# EAGLE design Propeller board rev 1.5 (EAGLE 9.2.2)
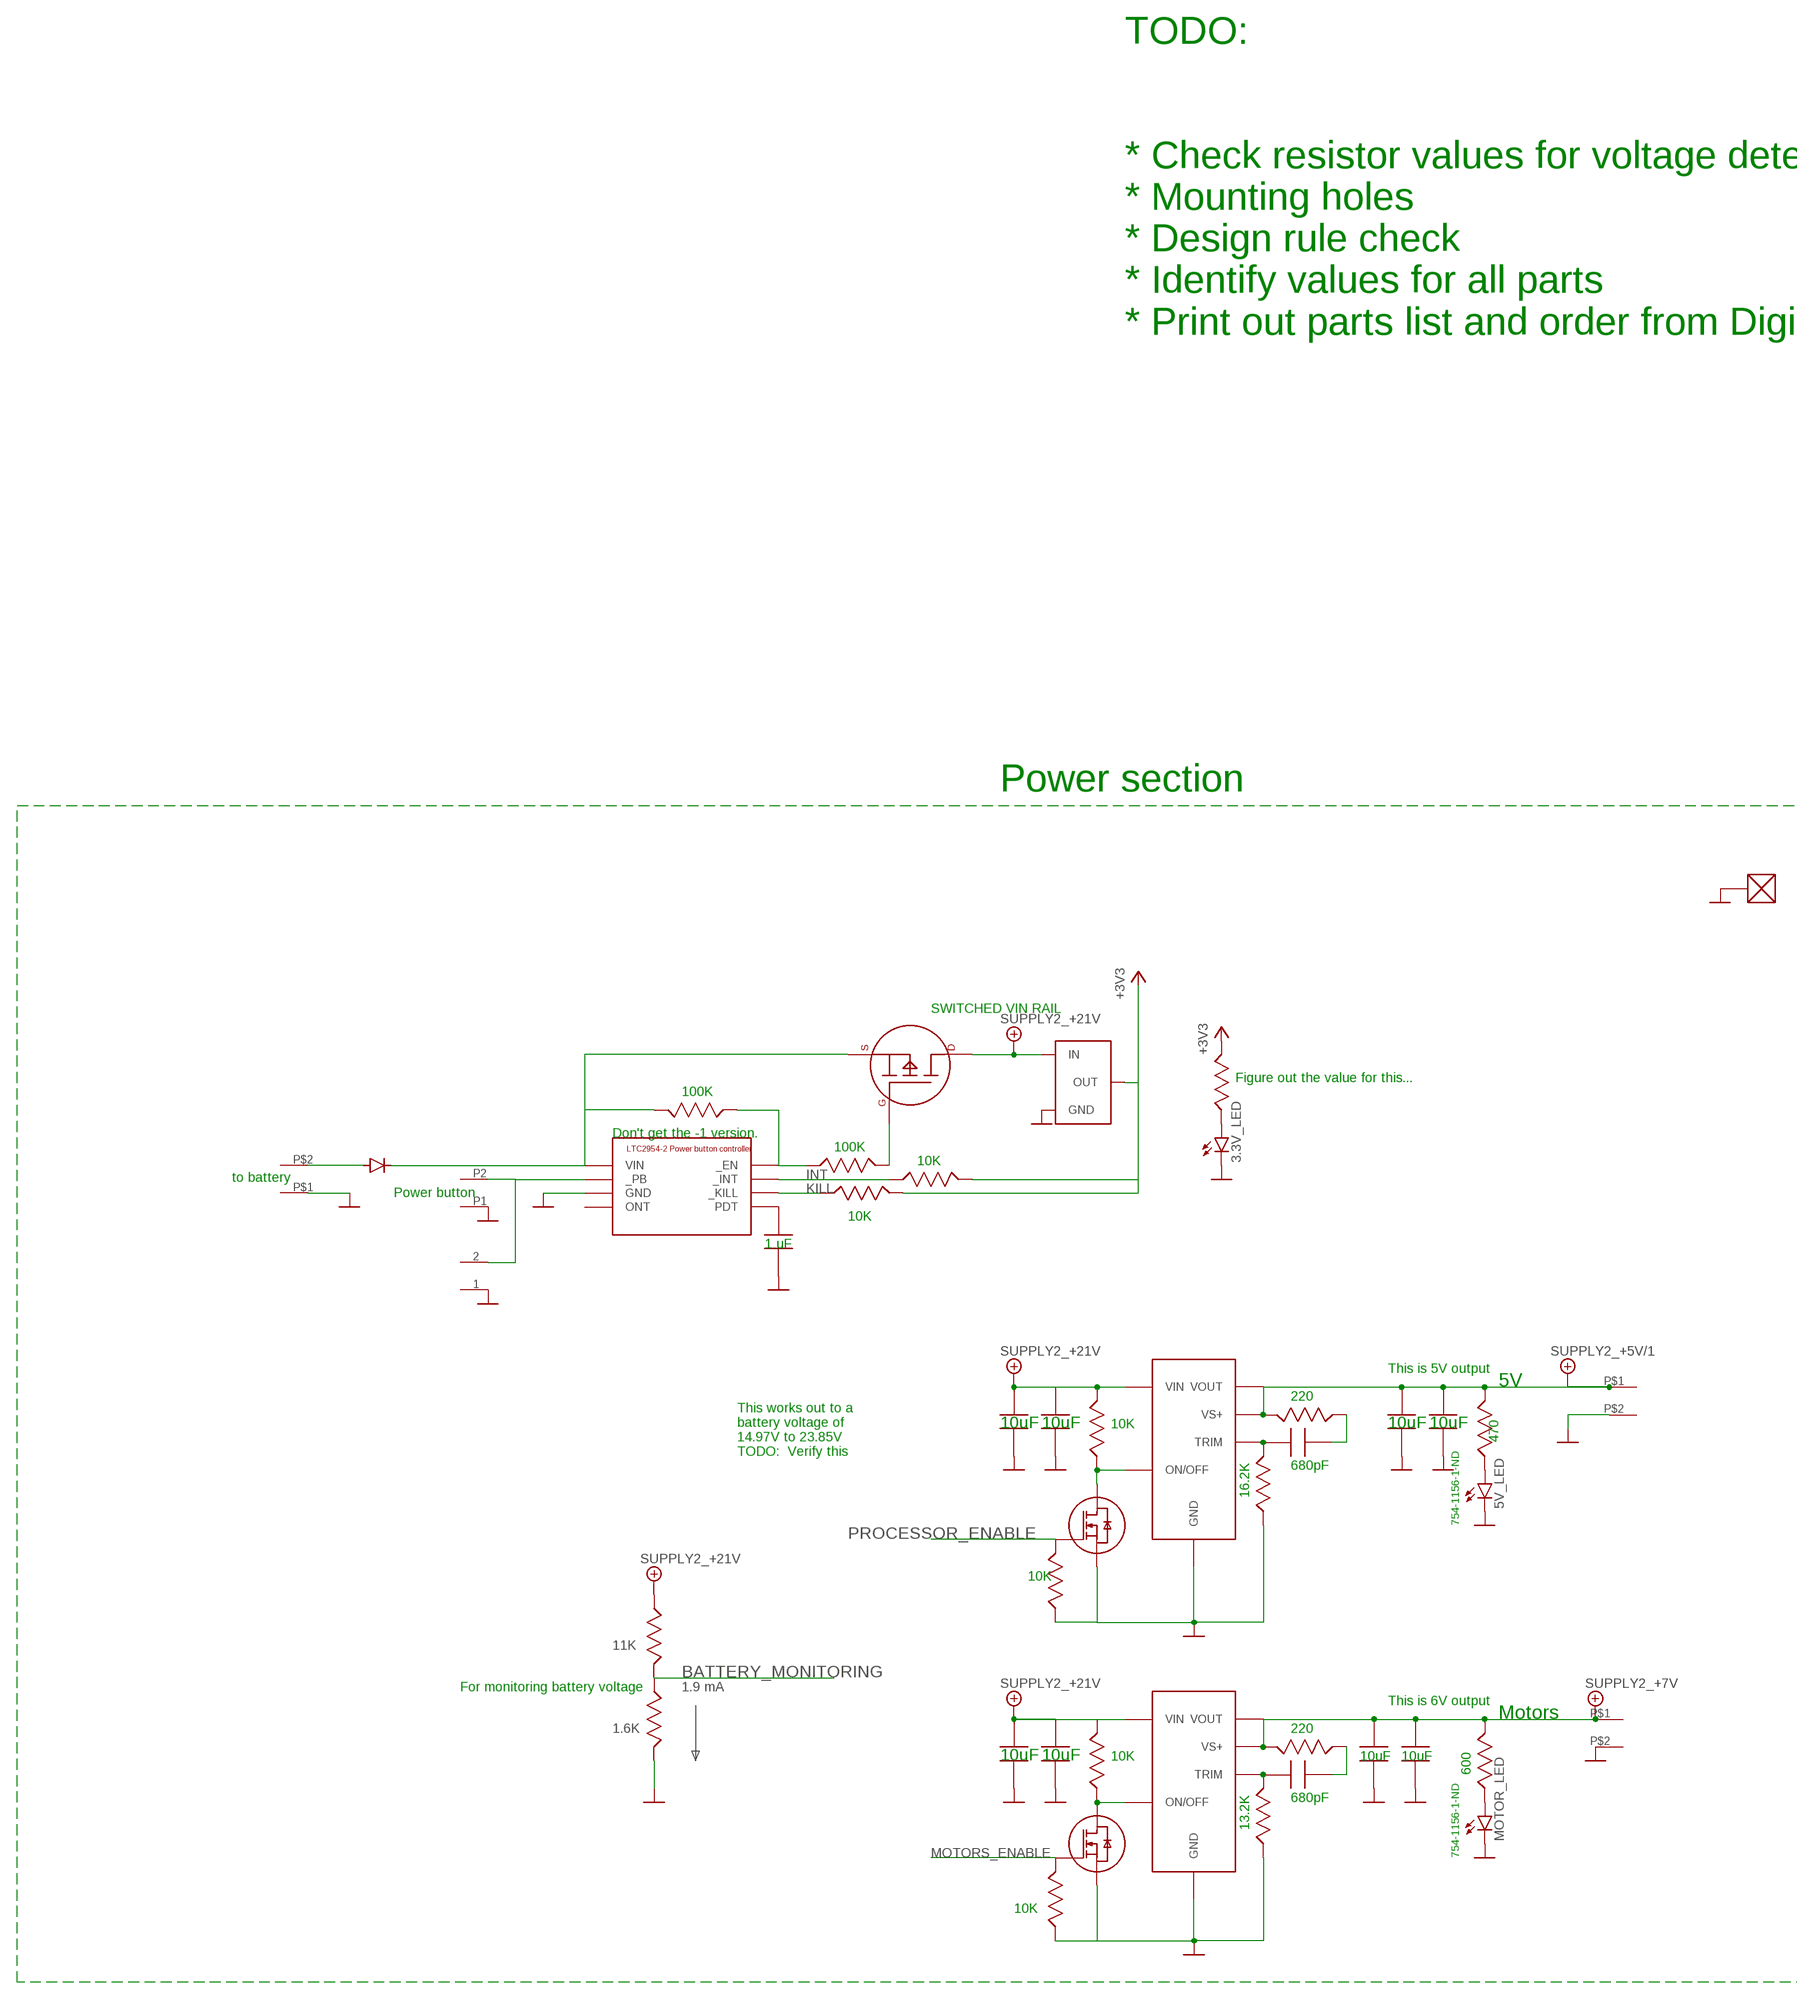
[diagram p0: schematic, sheet 1, part 1 of 2]
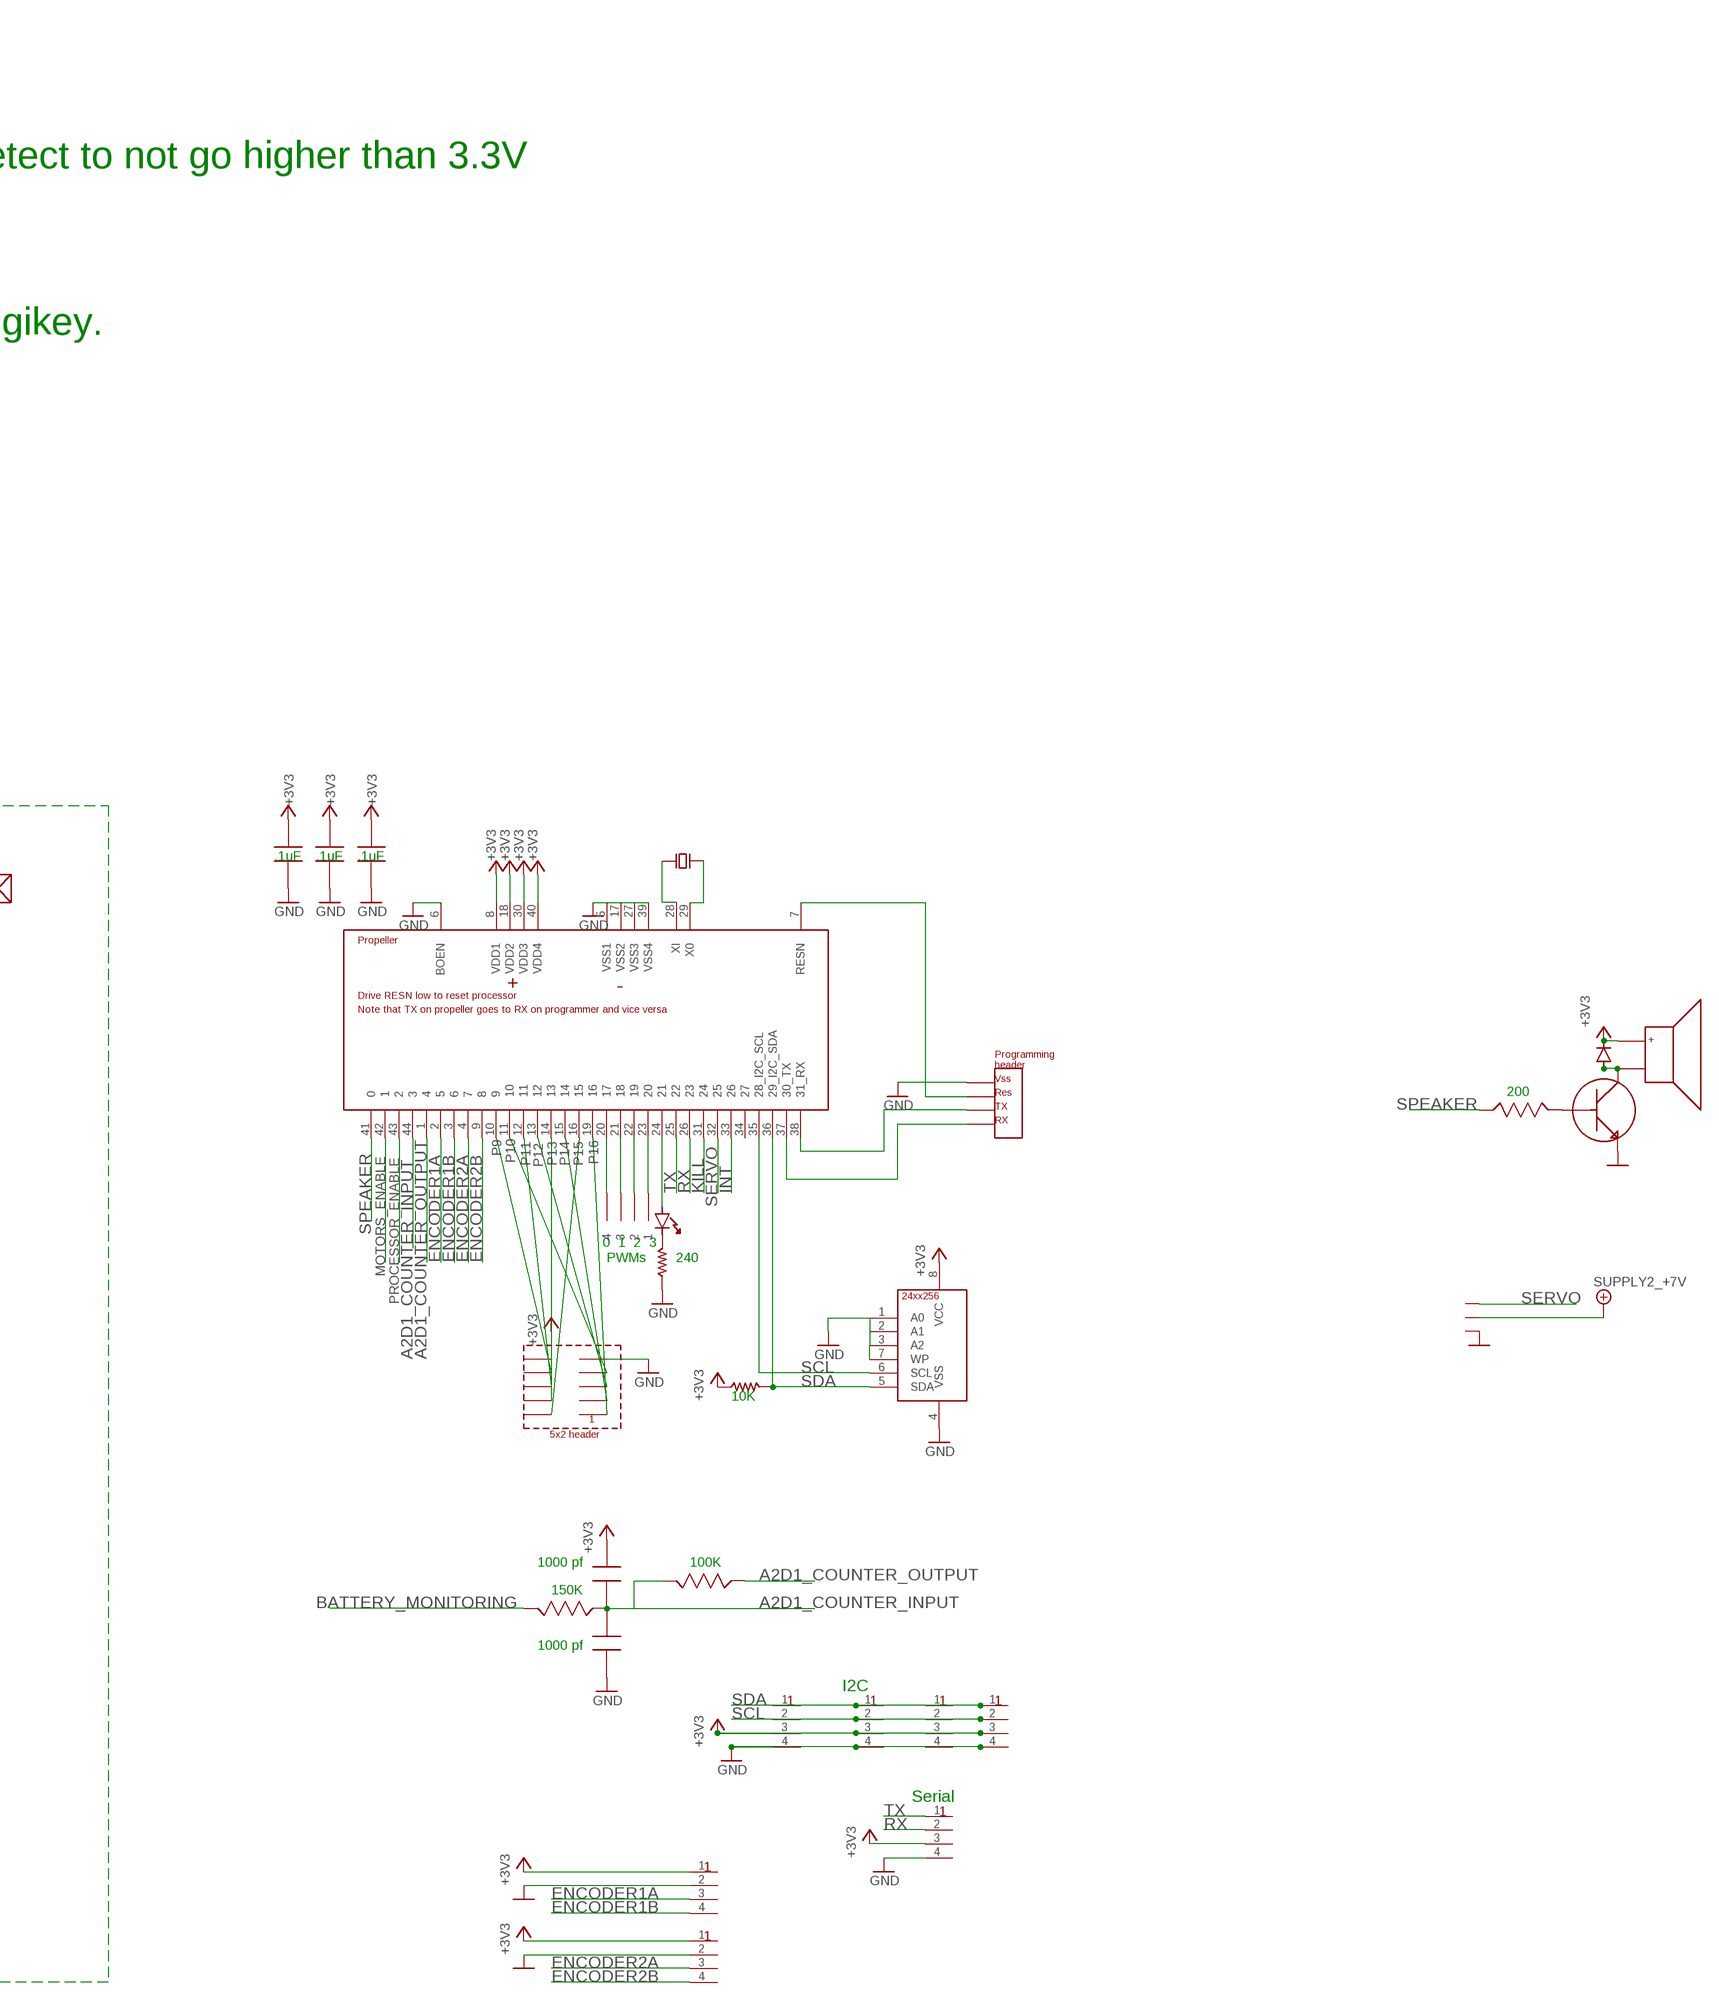
[diagram p1: schematic, sheet 1, part 2 of 2]

## Parts
3.3V_LED  LED_LEDSML1206  [LED_SML1206]
3V3_REGULATOR_FOR_PROPELLER  VOLTAGE_REGULATOR_3_TERMINALXP_POWER_VR05_SERIES  [VR05_SERIES_VREG]
5V_C_680PF  680pf  JACK_CAPACITOR0805  [JACK_0805]
5V_LED  LED_LEDSML1206  [LED_SML1206]
5V_LED_R1  470  JACK_RESISTOR0805  [JACK_0805]
5V_LED_R2  470  JACK_RESISTOR0805  [JACK_0805]
5V_R_220  220  JACK_RESISTOR0805  [JACK_0805]
5V_REGULATOR_PULLUP  10K  JACK_RESISTOR0805  [JACK_0805]
BATTERY_VOLTAGE_DIVIDER_HIGH  11K  JACK_RESISTOR0805  [JACK_0805]
BATTERY_VOLTAGE_DIVIDER_LOW  1.6K  JACK_RESISTOR0805  [JACK_0805]
MOTOR_C_680PF  680pf  JACK_CAPACITOR0805  [JACK_0805]
MOTOR_ENABLE_MOSFET  JACK_MOSFET_N_CHANNELBSS138LCT-ND  [JACK_SOT23]
MOTOR_ENABLE_MOSFET1  JACK_MOSFET_N_CHANNELBSS138LCT-ND  [JACK_SOT23]
MOTOR_LED  LED_LEDSML1206  [LED_SML1206]
MOTOR_LED_R  600  JACK_RESISTOR0805  [JACK_0805]
MOTOR_MOSFET_PULLDOWN  10K  JACK_RESISTOR0805  [JACK_0805]
MOTOR_PULLUP  10K  JACK_RESISTOR0805  [JACK_0805]
MOTOR_PULLUP2  10K  JACK_RESISTOR0805  [JACK_0805]
MOTOR_R_220  220  JACK_RESISTOR0805  [JACK_0805]
MOTOR_TRIM  13.2K  JACK_RESISTOR0805  [JACK_0805]
R1  240  RESISTOR0805  [805_SMD]
R25  10k  RESISTOR0805  [805_SMD]
RTRIM_5V  16.2K  JACK_RESISTOR0805  [JACK_0805]
U1  PARALLAX_PROPELLER  [44LQFP]
U2  EEPROM_24XX256  [8_MSOP]
U$1  CONNECTOR_2_PINJST_PH_SERIES  [JST_2_PIN_PH_SERIES]
U$2  JACK_SCREW_TERMINAL_2_CONDUCTORAMP-282837-2  [JACK_AMP-282837-2]
U$3  POWER_CONTROLLER_LTC2954-2TSOT-23-8  [TSOT-23-8]
U$4  JACK_DC_TO_DC_VARIABLE_555-1172-1-ND  [JACK_DC2DC_555-1172-1-ND]
U$5  1uf  CAPACITOR0805  [0805]
U$6  JACK_SCREW_TERMINAL_2_CONDUCTORAMP-282837-2  [JACK_AMP-282837-2]
U$7  100K  RESISTOR0805  [0805]
U$9  100K  RESISTOR0805  [0805]
U$10  10K  RESISTOR0805  [0805]
U$11  1000pF or 1nF  CAPACITOR0805  [0805]
U$12  MOSFET_P_CHANNELSI4431CDY  [SO8]
U$13  JACK_SCREW_TERMINAL_2_CONDUCTORAMP-282837-2  [JACK_AMP-282837-2]
U$14  .1uf  CAPACITOR0805  [0805]
U$15  CRYSTAL8X4.5_PACKAGE  [CRYSTAL_NX8045GB-5MHZ-STD-CSF-3]
U$16  .1uf  CAPACITOR0805  [0805]
U$17  JACK_DC_TO_DC_VARIABLE_555-1172-1-ND  [JACK_DC2DC_555-1172-1-ND]
U$18  .1uf  CAPACITOR0805  [0805]
U$19  TEST_POINT  [KEYSTONE_ELECTRONICS_5118_TEST_POINT]
U$20  LED0805  [0805]
U$21  HEADER_4_PIN_.1"  [FOUR_.1"_HOLES]
U$22  HEADER_5X2  [HEADER_5X2_.1"_SPACING]
U$23  CONNECTOR_4_PINJST_PH_SERIES  [JST_4_PIN_PH_SERIES]
U$24  CONNECTOR_4_PINJST_PH_SERIES  [JST_4_PIN_PH_SERIES]
U$25  CONNECTOR_4_PINJST_PH_SERIES  [JST_4_PIN_PH_SERIES]
U$26  CONNECTOR_2_PINJST_.1"  [JST_2_PIN_.1"]
U$27  10K  RESISTOR0805  [0805]
U$28  10uF  CAPACITOR  [1210]
U$29  10uF  CAPACITOR  [1210]
U$30  10uf  CAPACITOR  [1210]
U$31  10uf  CAPACITOR  [1210]
U$32  10uf  CAPACITOR  [1210]
U$33  10uf  CAPACITOR  [1210]
U$34  SPEAKERGT-0950RP3  [AUDIO_TRANSDUCER_GT-0950RP3]
U$35  DIODESOD523F  [SOD523F]
U$36  TRANSISTOR_NPNMMBT3904  [SOT23]
U$37  200  RESISTOR0805  [0805]
U$38  CONNECTOR_3_PIN.1"SPACING  [THREE_.1"_HOLES]
U$39  DIODEPOWER_DI15  [POWER_DI15]
U$40  10uf  CAPACITOR  [1210]
U$41  10uf  CAPACITOR  [1210]
U$42  1000pf or 1 nF  CAPACITOR0805  [0805]
U$43  150K  RESISTOR0805  [0805]
U$44  100K  RESISTOR0805  [0805]
U$45  CONNECTOR_4_PINJST_PH_SERIES  [JST_4_PIN_PH_SERIES]
U$46  CONNECTOR_4_PINJST_PH_SERIES  [JST_4_PIN_PH_SERIES]
U$47  CONNECTOR_4_PINJST_PH_SERIES  [JST_4_PIN_PH_SERIES]
U$48  PROPELLER_PROGRAMMING_HEADERHOLES  [FOUR_.1"HOLES]
U$49  CONNECTOR_4_PINJST_PH_SERIES  [JST_4_PIN_PH_SERIES]

## Nets
+3V3: 3V3_REGULATOR_FOR_PROPELLER.VOUT(OUT) 5V_LED_R2.P$3 R25.P$1 U1.8(VDD1) U1.18(VDD2) U1.30(VDD3) U1.40(VDD4) U2.8(VCC) U$10.C2 U$11.C2(2-) U$14.C2(2-) U$16.C2(2-) U$18.C2(2-) U$22.P10 U$23.3 U$24.3 U$25.3 U$27.C2 U$34.+ U$35.C U$45.3 U$46.1 U$47.3 U$49.1
+5V/1: 5V_LED_R1.P$3 5V_R_220.P$3 U$2.P$1 U$4.VOUT U$4.VS+ U$30.2(2-) U$33.2(2-) ; supply symbol labelled SUPPLY2_+5V/1
+7V: MOTOR_LED_R.P$3 MOTOR_R_220.P$3 U$13.P$1 U$17.VOUT U$17.VS+ U$32.2(2-) U$38.2 U$40.2(2-) ; supply symbol labelled SUPPLY2_+7V
+21V: 3V3_REGULATOR_FOR_PROPELLER.VIN(IN) 5V_REGULATOR_PULLUP.P$3 BATTERY_VOLTAGE_DIVIDER_HIGH.P$2 MOTOR_PULLUP.P$3 U$4.VIN U$12.5(D) U$12.6(D) U$12.7(D) U$12.8(D) U$17.VIN U$28.2(2-) U$29.2(2-) U$31.2(2-) U$41.2(2-) ; supply symbol labelled SUPPLY2_+21V
A2D1_COUNTER_INPUT: U1.44 U$11.A1(1+) U$42.C2(2-) U$43.A1 U$44.C2
A2D1_COUNTER_OUTPUT: U1.1 U$44.A1
BATTERY_MONITORING: BATTERY_VOLTAGE_DIVIDER_HIGH.P$3 BATTERY_VOLTAGE_DIVIDER_LOW.P$2 U$43.C2
ENCODER1A: U1.2 U$46.3
ENCODER1B: U1.3 U$46.4
ENCODER2A: U1.4 U$49.3
ENCODER2B: U1.9 U$49.4
GND: 3.3V_LED.C 3V3_REGULATOR_FOR_PROPELLER.GND 5V_LED.C BATTERY_VOLTAGE_DIVIDER_LOW.P$3 MOTOR_ENABLE_MOSFET1.2(S) MOTOR_ENABLE_MOSFET.2(S) MOTOR_LED.C MOTOR_MOSFET_PULLDOWN.P$2 MOTOR_PULLUP2.P$2 MOTOR_TRIM.P$2 R1.P$1 RTRIM_5V.P$2 U1.5(VSS1) U1.6(BOEN) U1.17(VSS2) U1.27(VSS3) U1.39(VSS4) U2.1(A0) U2.2(A1) U2.3(A2) U2.4(VSS) U2.7(WP) U$1.P1 U$2.P$2 U$3.4(GND) U$4.GND U$5.A1(1+) U$6.P$1 U$13.P$2 U$14.A1(1+) U$16.A1(1+) U$17.GND U$18.A1(1+) U$19.P1 U$22.P9 U$23.4 U$24.4 U$25.4 U$26.1 U$28.1(1+) U$29.1(1+) U$30.1(1+) U$31.1(1+) U$32.1(1+) U$33.1(1+) U$36.2(E) U$38.1 U$40.1(1+) U$41.1(1+) U$42.A1(1+) U$45.4 U$46.2 U$47.4 U$48.1(VSS) U$49.2 ; supply symbol labelled SUPPLY1_GND
INT: U1.33 U$3.5(_INT) U$10.A1
KILL: U1.31 U$3.8(_KILL) U$27.A1
MOTORS_ENABLE: MOTOR_ENABLE_MOSFET.1(G) MOTOR_MOSFET_PULLDOWN.P$3 U1.42
N$1: U1.7(RESN) U$48.2(RES)
N$3: U1.24 U$20.A1(A)
N$4: U$1.P2 U$3.2(_PB) U$26.2
N$5: MOTOR_LED.A MOTOR_LED_R.P$2
N$6: U$3.1(VIN) U$7.C2 U$12.1(S) U$12.2(S) U$12.3(S) U$39.3(C)
N$7: U$3.7(PDT) U$5.C2(2-)
N$8: U$3.6(_EN) U$7.A1 U$9.A1
N$9: MOTOR_ENABLE_MOSFET.3(D) MOTOR_PULLUP.P$2 U$17.ON/OFF
N$10: U$9.C2 U$12.4(G)
N$11: R1.P$2 U$20.C2(C)
N$12: U1.23 U$21.1
N$13: U1.22 U$21.2
N$14: U1.21 U$21.3
N$15: U$34.- U$35.A U$36.3(C)
N$16: U$36.1(B) U$37.C2
N$17: U1.20 U$21.4
N$21: 5V_C_680PF.P$3 RTRIM_5V.P$3 U$4.TRIM
N$23: 3.3V_LED.A 5V_LED_R2.P$2
N$24: U$6.P$2 U$39.1(A) U$39.2(A)
N$26: U1.38(31_RX) U$48.3(TX)
N$29: 5V_LED.A 5V_LED_R1.P$2
N$32: 5V_REGULATOR_PULLUP.P$2 MOTOR_ENABLE_MOSFET1.3(D) U$4.ON/OFF
N$33: 5V_C_680PF.P$2 5V_R_220.P$2
N$35: MOTOR_C_680PF.P$3 MOTOR_TRIM.P$3 U$17.TRIM
N$37: MOTOR_C_680PF.P$2 MOTOR_R_220.P$2
N$299: U1.37(30_TX) U$48.4(RX)
N$300: U1.28(XI) U$15.1
N$301: U1.29(X0) U$15.2
P9: U1.10 U$22.P8
P10: U1.11 U$22.P7
P11: U1.12 U$22.P6
P12: U1.13 U$22.P5
P13: U1.14 U$22.P4
P14: U1.15 U$22.P3
P15: U1.16 U$22.P2
P16: U1.19 U$22.P1
PROCESSOR_ENABLE: MOTOR_ENABLE_MOSFET1.1(G) MOTOR_PULLUP2.P$3 U1.43
RX: U1.26 U$47.2
SCL: U1.35(28_I2C_SCL) U2.6(SCL) U$23.2 U$24.2 U$25.2 U$45.2
SDA: R25.P$2 U1.36(29_I2C_SDA) U2.5(SDA) U$23.1 U$24.1 U$25.1 U$45.1
SERVO: U1.32 U$38.3
SPEAKER: U1.41 U$37.A1
TX: U1.25 U$47.1
Unconnected: U1.34 U$3.3(ONT)

## Notes on the sheet
- TODO:
  
  
  * Check resistor values for voltage detect to not go higher than 3.3V
  * Mounting holes
  * Design rule check
  * Identify values for all parts
  * Print out parts list and order from Digikey.
- Power section
- .1uF | .1uF | .1uF
- SWITCHED VIN RAIL
- Figure out the value for this...
- 100K | 200
- Don't get the -1 version.
- 100K
- 10K
- to battery
- Power button
- 10K
- 1 uF | 0  1  2  3
- PWMs | 240
- This is 5V output
- 5V
- 220 | 10K
- 10uF | 10uF | 10K | 10uF | 10uF
- 470
- This works out to a
  battery voltage of
  14.97V to 23.85V
  TODO:  Verify this
- 680pF
- 16.2K
- 754-1156-1-ND
- 1000 pf | 100K
- 10K
- 150K
- 11K | 1000 pf
- For monitoring battery voltage | 1.9 mA | I2C
- This is 6V output
- Motors
- 1.6K | 220
- 10uF | 10uF | 10K | 10uF | 10uF
- 600
- 680pF | Serial
- 13.2K
- 754-1156-1-ND
- 10K

## Library data of the parts
3.3V_LED 5V_LED MOTOR_LED = arduino board rev 1.3:LED_LED: LED OSRAM: - CHIPLED LG R971, LG N971, LY N971, LG Q971, LY Q971, LO R971, LY R971 LH N974, LH R974 LS Q976, LO Q976, LY Q976 LO Q996 - Hyper CHIPLED LW Q18S LB Q993, LB Q99A, LB R99A - SideLED LS A670, LO A670, LY A670, LG A670, LP A670 LB A673, LV A673, LT A673, LW A673 LH A674 LY A675 LS A676, LA A676, LO A676, LY A676, LW A676 LS A679, LY A679, LG A679 - Hyper Micro SIDELED® LS Y876, LA Y876, LO Y876, LY Y876 LT Y87S - SmartLED LW L88C, LW L88S LB L89C, LB L89S, LG L890 LS L89K, LO L89K, LY L89K LS L896, LA L896, LO L896, LY L896 - TOPLED LS T670, LO T670, LY T670, LG T670, LP T670 LSG T670, LSP T670, LSY T670, LOP T670, LYG T670 LG T671, LOG T671, LSG T671 LB T673, LV T673, LT T673, LW T673 LH T674 LS T676, LA T676, LO T676, LY T676, LB T676, LH T676, LSB T676, LW T676 LB T67C, LV T67C, LT T67C, LS T67K, LO T67K, LY T67K, LW E67C LS E67B, LA E67B, LO E67B, LY E67B, LB E67C, LV E67C, LT E67C LW T67C LS T679, LY T679, LG T679 LS T770, LO T770, LY T770, LG T770, LP T770 LB T773, LV T773, LT T773, LW T773 LH T774 LS E675, LA E675, LY E675, LS T675 LS T776, LA T776, LO T776, LY T776, LB T776 LHGB T686 LT T68C, LB T68C - Hyper Mini TOPLED® LB M676 - Mini TOPLED Santana® LG M470 LS M47K, LO M47K, LY M47K Source: http://www.osram.convergy.de LUXEON: - LUMILED® LXK2-PW12-R00, LXK2-PW12-S00, LXK2-PW14-U00, LXK2-PW14-V00 LXK2-PM12-R00, LXK2-PM12-S00, LXK2-PM14-U00 LXK2-PE12-Q00, LXK2-PE12-R00, LXK2-PE12-S00, LXK2-PE14-T00, LXK2-PE14-U00 LXK2-PB12-K00, LXK2-PB12-L00, LXK2-PB12-M00, LXK2-PB14-N00, LXK2-PB14-P00, LXK2-PB14-Q00 LXK2-PR12-L00, LXK2-PR12-M00, LXK2-PR14-Q00, LXK2-PR14-R00 LXK2-PD12-Q00, LXK2-PD12-R00, LXK2-PD12-S00 LXK2-PH12-R00, LXK2-PH12-S00 LXK2-PL12-P00, LXK2-PL12-Q00, LXK2-PL12-R00 Source: www.luxeon.com KINGBRIGHT: KA-3528ASYC Source: www.kingbright.com
3V3_REGULATOR_FOR_PROPELLER = Jack:VOLTAGE_REGULATOR_3_TERMINAL
5V_C_680PF MOTOR_C_680PF = arduino board rev 1.3:JACK_CAPACITOR
5V_LED_R1 5V_LED_R2 5V_R_220 5V_REGULATOR_PULLUP BATTERY_VOLTAGE_DIVIDER_HIGH BATTERY_VOLTAGE_DIVIDER_LOW MOTOR_LED_R MOTOR_MOSFET_PULLDOWN MOTOR_PULLUP MOTOR_PULLUP2 MOTOR_R_220 MOTOR_TRIM RTRIM_5V = arduino board rev 1.3:JACK_RESISTOR
MOTOR_ENABLE_MOSFET MOTOR_ENABLE_MOSFET1 = arduino board rev 1.3:JACK_MOSFET_N_CHANNEL
R1 R25 = jack_custom:RESISTOR
U1 = jack_custom:PARALLAX_PROPELLER
U2 = jack_custom:EEPROM_24XX256
U$1 U$26 = Jack:CONNECTOR_2_PIN
U$2 U$6 U$13 = arduino board rev 1.3:JACK_SCREW_TERMINAL_2_CONDUCTOR
U$3 = Jack:POWER_CONTROLLER_LTC2954-2
U$4 U$17 = arduino board rev 1.3:JACK_DC_TO_DC_VARIABLE_555-1172-1-ND
U$5 U$11 U$14 U$16 U$18 U$28-U$33 U$40-U$42 = Jack:CAPACITOR
U$7 U$9 U$10 U$27 U$37 U$43 U$44 = Jack:RESISTOR
U$12 = Jack:MOSFET_P_CHANNEL
U$15 = Jack:CRYSTAL
U$19 = Jack:TEST_POINT
U$20 = Jack:LED
U$21 = Jack:HEADER_4_PIN_.1"
U$22 = Jack:HEADER_5X2
U$23-U$25 U$45-U$47 U$49 = Jack:CONNECTOR_4_PIN
U$34 = Jack:SPEAKER
U$35 U$39 = Jack:DIODE
U$36 = Jack:TRANSISTOR_NPN
U$38 = Jack:CONNECTOR_3_PIN
U$48 = Jack:PROPELLER_PROGRAMMING_HEADER

## Net classes
0 default: clearance 0.254 mm

## Board
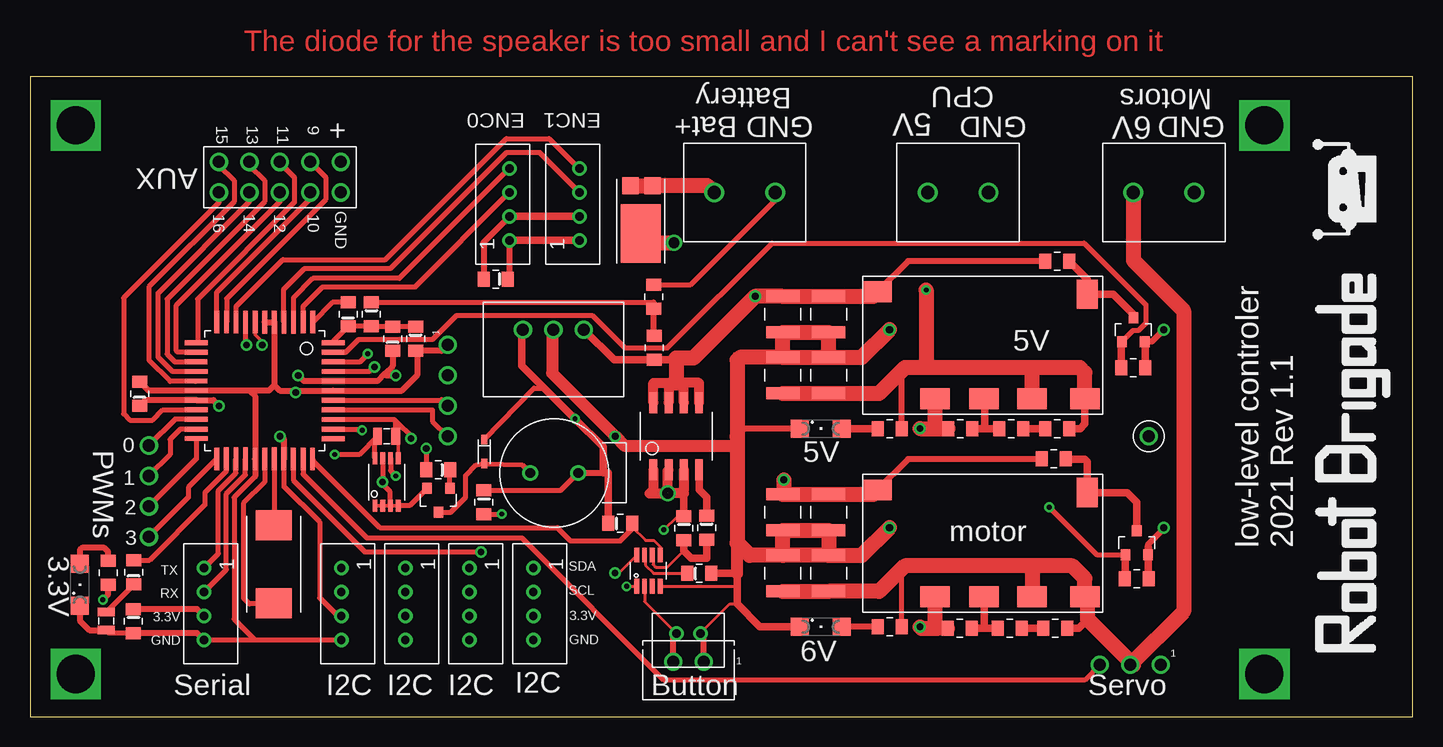
[diagram p2: board, top side]
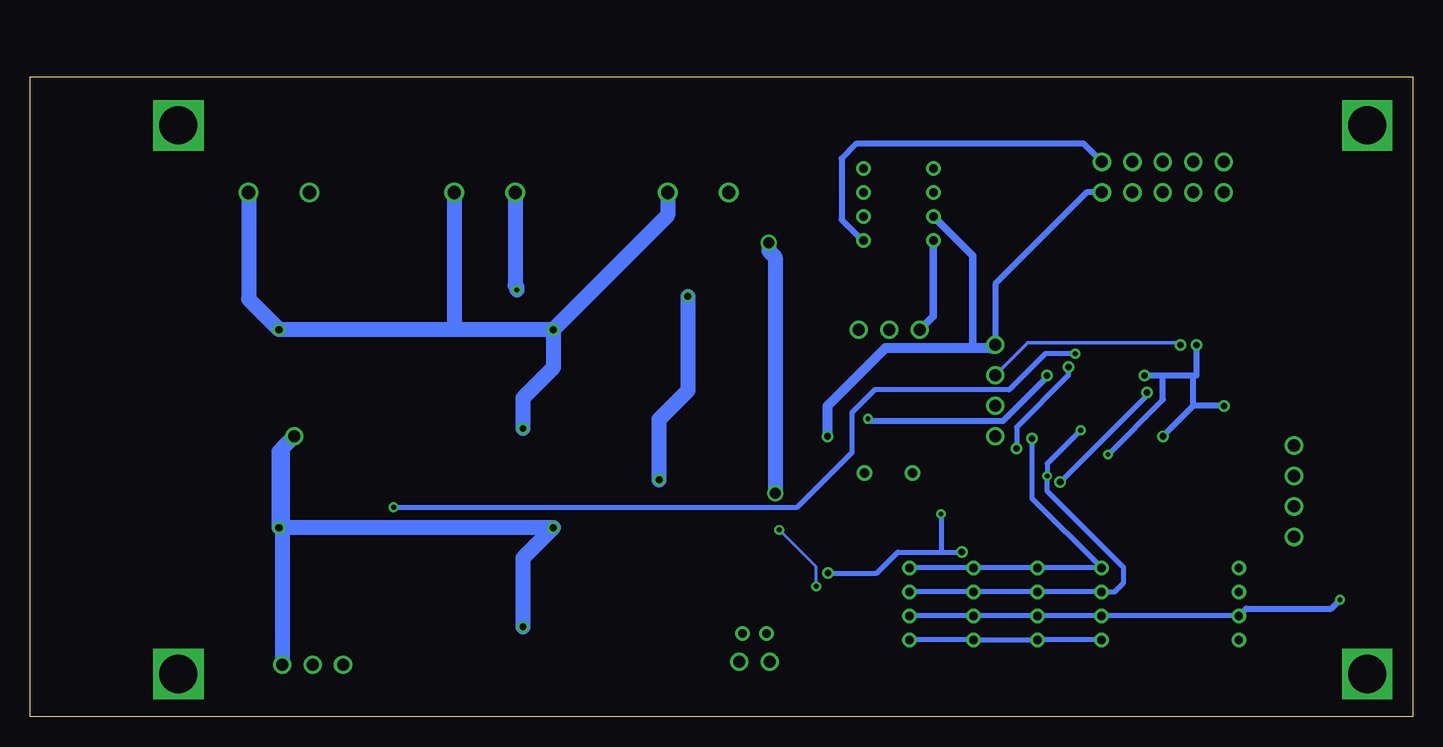
[diagram p3: board, bottom side, seen from below]

Size 115.24 x 53.33 mm. Coordinates in mm from the lower left corner, seen from the top.
Outline: 0,0 115.24,0 115.24,53.33 0,53.33 0,0
Copper layers (1*16): Top 0.035mm / dielectric 1.5mm / Bottom 0.035mm
Design rules "default *": minimum track width 6mil, minimum drill 0.4mm, track to track 8mil, track to pad 8mil, pad to pad 8mil, via to via 8mil, smd to smd 8mil, copper to edge 40mil, drill to drill 6mil, minimum pad ring 10mil, minimum via ring 8mil, stop-mask expansion 4mil, vias tented up to drill 0mil, thermal gap 10mil

### Footprints (pad centres in the part's own frame; a part is rotated, then mirrored left to right if it is on the bottom)
LED_SML1206 = smd 1.5 x 1.5: A 1.75,0; C -1.75,0
VR05_SERIES_VREG = drill 1: GND 0,0; VIN -2.54,0; VOUT 2.54,0
JACK_0805 = smd 1 x 1.25: P$2 -1,0; P$3 1,0
JACK_SOT23 = smd 0.8 x 0.9: 1 -0.95,-1; 2 0.95,-1; 3 0,1
805_SMD = smd 0.711 x 1.422: P$1 -0.762,0; P$2 0.762,0
44LQFP = smd 1.9 x 0.4: 1 -5.71,4.009; 2 -5.71,3.208; 3 -5.705,2.401; 4 -5.7,1.603; 5 -5.7,0.805; 6 -5.7,0; 7 -5.707,-0.792; 8 -5.7,-1.596; 9 -5.709,-2.389; 10 -5.709,-3.182; 11 -5.709,-4.003; 23 5.696,-3.984; 24 5.691,-3.209; 25 5.691,-2.399; 26 5.691,-1.607; 27 5.696,-0.801; 28 5.7,0; 29 5.691,0.793; 30 5.689,1.599; 31 5.7,2.38; 32 5.7,3.202; 33 5.7,3.991 | smd 0.4 x 1.9: 12 -3.996,-5.706; 13 -3.203,-5.713; 14 -2.398,-5.719; 15 -1.586,-5.712; 16 -0.799,-5.719; 17 0,-5.7; 18 0.805,-5.7; 19 1.601,-5.7; 20 2.385,-5.71; 21 3.217,-5.7; 22 3.996,-5.7; 34 4.004,5.715; 35 3.212,5.715; 36 2.413,5.707; 37 1.606,5.715; 38 0.807,5.715; 39 0,5.7; 40 -0.792,5.707; 41 -1.591,5.707; 42 -2.405,5.707; 43 -3.19,5.7; 44 -3.996,5.707
8_MSOP = smd 0.4 x 1: 1 -0.975,-1.975; 2 -0.325,-1.975; 3 0.325,-1.975; 4 0.975,-1.975; 5 0.975,1.975; 6 0.325,1.975; 7 -0.325,1.975; 8 -0.975,1.975
JST_2_PIN_PH_SERIES = drill 0.7: P1 -1,1.7; P2 1,1.7
JACK_AMP-282837-2 = drill 1.1: P$1 -2.54,0; P$2 2.54,0
TSOT-23-8 = smd 0.4 x 1.22: 1 -0.975,-1.3; 2 -0.325,-1.3; 3 0.325,-1.3; 4 0.975,-1.3; 5 0.975,1.3; 6 0.325,1.3; 7 -0.325,1.3; 8 -0.975,1.3
JACK_DC2DC_555-1172-1-ND = smd 2.44 x 1.73: GND 14,10.2; TRIM 9.9,10.2; VIN 18.8,1.3; VOUT 5.9,10.2; VS+ 1.5,10.2 | smd 1.73 x 2.44: ON/OFF 1.3,1.5
0805 = smd 1 x 1.25: A1 -1,0; C2 1,0
SO8 = smd 0.65 x 1.75: 1 -1.9,-2.8; 2 -0.63,-2.8; 3 0.64,-2.8; 4 1.91,-2.8; 5 1.91,2.8; 6 0.64,2.8; 7 -0.63,2.8; 8 -1.9,2.8
CRYSTAL_NX8045GB-5MHZ-STD-CSF-3 = smd 2.5 x 3: 1 3.25,0; 2 -3.25,0
KEYSTONE_ELECTRONICS_5118_TEST_POINT = drill 1: P1 0,0
FOUR_.1"_HOLES = drill 1.016: 1 -3.81,0; 2 -1.27,0; 3 1.27,0; 4 3.81,0
HEADER_5X2_.1"_SPACING = drill 1: P1 0,5.08; P2 2.54,5.08; P3 0,2.54; P4 2.54,2.54; P5 0,0; P6 2.54,0; P7 0,-2.54; P8 2.54,-2.54; P9 0,-5.08; P10 2.54,-5.08
JST_4_PIN_PH_SERIES = drill 0.7: 1 -3,0.03; 2 -1,0.03; 3 1,0.03; 4 3,0.03
JST_2_PIN_.1" = drill 1: 1 -1.27,0; 2 1.27,0
1210 = smd 1 x 2.8: 1 -1.5,0; 2 1.5,0
AUDIO_TRANSDUCER_GT-0950RP3 = drill 0.8: + 0,-2; - 0,2
SOD523F = smd 0.8 x 0.5: A -1,0; C 1,0
SOT23 = smd 0.8 x 0.9: 1 -0.95,-1; 2 0.95,-1; 3 0,1
THREE_.1"_HOLES = drill 1: 1 -2.54,0; 2 0,0; 3 2.54,0
POWER_DI15 = smd 1.4 x 1.4: 1 -1.458,0.976; 2 -1.458,-0.864 | smd 4.86 x 3.36: 3 2.54,0
FOUR_.1"HOLES = drill 1: 1 -3.81,0; 2 -1.27,0; 3 1.27,0; 4 3.81,0

### Placement (x,y rotation side)
3.3V_LED  4.17,11 90 top
3V3_REGULATOR_FOR_PROPELLER  43.62,32.24 180 top
5V_C_680PF  81.79,24 180 top
5V_LED  65.91,24 0 top
5V_LED_R1  71.63,24 0 top
5V_LED_R2  6.5,11.99 270 top
5V_R_220  85.6,24 0 top
5V_REGULATOR_PULLUP  85.6,37.97 180 top
BATTERY_VOLTAGE_DIVIDER_HIGH  52,30.73 90 top
BATTERY_VOLTAGE_DIVIDER_LOW  51.98,35.01 90 top
MOTOR_C_680PF  81.65,7.37 180 top
MOTOR_ENABLE_MOSFET  92.23,14.51 0 top
MOTOR_ENABLE_MOSFET1  91.95,32.26 0 top
MOTOR_LED  65.91,7.49 0 top
MOTOR_LED_R  71.63,7.49 0 top
MOTOR_MOSFET_PULLDOWN  92.23,11.51 180 top
MOTOR_PULLUP  85.31,21.49 180 top
MOTOR_PULLUP2  91.95,29.08 180 top
MOTOR_R_220  85.46,7.37 0 top
MOTOR_TRIM  77.47,7.37 0 top
R1  6.35,7.98 90 top
R25  29.72,23.37 0 top
RTRIM_5V  77.51,24 0 top
U1  19.56,27.18 270 top
U2  29.72,19.56 0 top
U$1  54.86,8.64 180 top
U$2  77.34,43.69 0 top
U$3  51.54,12.17 0 top
U$4  89.41,36.7 180 top
U$5  55.75,11.94 180 top
U$6  59.56,43.69 180 top
U$7  54.48,15.72 90 top
U$8  [ROBOT_BRIGADE_LOGO_AND_TEXT_.2"]  113.54,4.45 90 top
U$9  56.39,15.75 90 top
U$10  49.2,16.1 180 top
U$11  30.23,31.5 270 top
U$12  53.85,23.37 0 top
U$13  94.49,43.69 0 top
U$14  8.61,7.98 90 top
U$15  20.32,12.7 270 top
U$16  9.14,26.92 270 top
U$17  89.41,20.19 180 top
U$18  38.81,36.47 0 top
U$19  93.22,23.37 0 top
U$20  8.64,12.04 270 top
U$21  9.91,18.8 90 top
U$22  20.83,43.69 90 top
U$23  36.58,9.4 270 top
U$24  31.24,9.4 270 top
U$25  41.91,9.4 270 top
U$26  54.86,4.57 180 top
U$27  37.82,17.86 90 top
U$28  62.74,17.02 90 top
U$29  62.74,33.53 90 top
U$30  62.74,28.45 270 top
U$31  66.55,33.53 90 top
U$32  62.74,11.94 270 top
U$33  66.55,28.45 270 top
U$34  43.69,20.32 90 top
U$35  37.85,22.1 90 top
U$36  34.04,18.03 180 top
U$37  34.04,20.57 0 top
U$38  91.69,4.32 180 top
U$39  50.9,42.8 270 top
U$40  66.55,11.94 270 top
U$41  66.55,17.02 90 top
U$42  32.13,31.5 90 top
U$43  28.45,33.53 90 top
U$44  26.52,33.53 270 top
U$45  25.91,9.4 270 top
U$46  39.98,42.7 90 top
U$47  14.48,9.4 270 top
U$48  34.8,27.18 270 top
U$49  45.82,42.7 90 top

### Tracks (layer width: path | path; a pad name or v marks a point on that pad's centre or on a via)
+3V3  (via drill 0.4, 0.55)
  Top 0.305: 28.74,23.16 arc-90 R25.P$1
  Top 0.406: U2.8 28.74,23.16 | v18.03,30.99 arc-90 17.96,31.06 U1.8 | U1.30 21.16,19.2 24.13,16.23 24.13,9.91 25.64,8.4 U$45.3 | 29.58,28.58 29.72,28.45 | R25.P$1 27.43,21.84 v25.4,21.84 | 40.98,32.14 3V3_REGULATOR_FOR_PROPELLER.VOUT | U$35.C 42.01,27.38 42.87,27.38 | U$27.C2 44.22,18.86 U$34.+
  Top 0.508: v15.75,25.91 15.28,26.37 U1.18 9.59,26.37 U$16.C2 | v20.83,23.37 arc-90 21.16,23.04 U1.30 | v22.35,28.45 22.83,27.97 U1.40 28.97,27.97 29.58,28.58 30.23,29.23 U$11.C2 | 29.72,28.45 v30.48,28.45 | U$47.3 13.93,8.98 U$14.C2 | U$46.1 39.95,36.61 U$18.C2 | U$34.+ 47.77,20.32 48.2,20.32 | v6.07,9.75 6.5,10.18 5V_LED_R2.P$3
  Top 0.61: U$10.C2 48.2,20.32 | 47.77,20.32 47.77,22.48 v45.41,24.84 42.87,27.38 40.98,29.26 40.98,32.14 | U$46.1 U$49.1
  Bottom 0.254: 45.48,24.64 45.41,24.71
  Bottom 0.406: 18.29,28.45 18.03,28.45 | U$47.3 U$45.3 U$24.3 U$23.3 U$25.3 | v25.4,21.84 20.83,26.42
  Bottom 0.508: v15.75,25.91 18.29,25.91 | 18.29,25.91 v20.83,23.37 | 18.29,25.91 18.29,28.45 20.83,28.45 | v18.03,30.99 18.03,28.45 | v22.35,28.45 20.83,28.45 | 45.48,24.64 34.16,24.64 30.48,28.32 v30.48,28.45 | 20.83,26.42 20.83,28.45 | U$22.P10 27.46,47.78 46.33,47.78 47.6,46.51 47.6,41.43 45.87,39.7 | 45.41,24.71 v45.41,24.84 | U$47.3 13.9,9.01 6.79,9.01 6.07,9.73 v6.07,9.75
  Bottom 0.61: U$46.1 39.95,33.37 3V3_REGULATOR_FOR_PROPELLER.VOUT
  Bottom 0.813: 45.87,39.7 U$49.1
+5V/1  (via drill 0.4)
  Top 0.508: 5V_LED_R1.P$3 72.63,28.72 72.58,28.77
  Top 0.61: 5V_R_220.P$3 87.5,24 87.91,24.41 U$4.VS+
  Top 1.27: U$4.VOUT 83.51,29.08 | U$4.VS+ 87.91,28.68 87.5,29.08 83.51,29.08 | U$30.2 U$33.2 70.76,26.95 72.58,28.77 72.9,29.08 74.68,29.08 | 83.51,29.08 74.68,29.08 | v74.68,35.56 74.68,29.08
  Bottom 1.27: U$2.P$1 74.8,35.94 74.68,35.81 v74.68,35.56
+7V
  Top 0.406: MOTOR_LED_R.P$3 72.63,12.3 72.9,12.57 | U$38.2 91.95,4.32
  Top 0.61: MOTOR_R_220.P$3 87.38,7.37 88.14,8.13 | 88.14,9.76 U$17.VS+
  Top 1.27: U$17.VS+ 87.91,11.53 86.87,12.57 83.57,12.57 | 83.57,12.57 83.51,12.52 U$17.VOUT | 83.57,12.57 72.9,12.57 70.76,10.44 U$40.2 U$32.2 | 88.14,9.76 88.14,8.13 91.95,4.32 | U$38.2 96.13,8.76 96.13,33.85 91.95,38.04 U$13.P$1
+21V  (via drill 0.6)
  Top 0.508: U$17.VIN 73.15,21.43 73.15,21.46 84.29,21.46 | 5V_REGULATOR_PULLUP.P$3 73.18,37.97 U$4.VIN | 53.87,29.77 53.83,29.73
  Top 0.61: MOTOR_PULLUP.P$3 84.29,21.46 | 53.83,29.73 BATTERY_VOLTAGE_DIVIDER_HIGH.P$2 48.67,29.73 3V3_REGULATOR_FOR_PROPELLER.VIN
  Top 0.813: U$12.8 51.95,27.81 51.94,27.81 53.21,27.81 53.22,27.81 | 53.22,27.81 U$12.7 | U$12.5 55.75,27.81 54.48,27.81 | 54.48,27.81 53.85,27.81 53.22,27.81 | U$12.6 54.49,27.81 54.48,27.81
  Top 1.27: U$17.VIN 70.23,18.52 U$41.2 U$28.2 62.81,18.59 v62.81,19.74 | U$4.VIN 70.23,35.03 U$31.2 U$29.2 v60.43,35.03 55.27,29.88 53.87,29.88 | 53.87,29.88 53.85,29.88 53.85,27.81 | 53.87,29.77 53.87,29.88
  Bottom 1.27: v60.43,35.03 60.43,27.18 62.81,24.79 v62.81,19.74
A2D1_COUNTER_INPUT
  Top 0.406: U$42.C2 U$11.A1 28.48,32.5 U$43.A1 U$44.C2 25.27,31.28 U1.44
A2D1_COUNTER_OUTPUT
  Top 0.406: 26.43,34.61 U$44.A1 25.21,34.53 U1.1
BATTERY_MONITORING
  Top 0.406: U$43.C2 28.46,34.52 51.98,34.52
  Top 0.508: BATTERY_VOLTAGE_DIVIDER_HIGH.P$3 51.98,31.7 BATTERY_VOLTAGE_DIVIDER_LOW.P$2 51.98,34.52
ENCODER1A
  Top 0.406: U1.2 22.77,34.2 24.37,35.8 32.05,35.8 U$46.3
ENCODER1B
  Top 0.406: U1.3 21.96,34.91 23.57,36.53 30.78,36.53 U$46.4
ENCODER2A
  Top 0.406: U1.4 21.16,35.64 22.86,37.34 30.03,37.34 39.7,47 42.49,47 U$49.3
ENCODER2B
  Top 0.406: U1.9 17.17,34.19 21.08,38.1 29.62,38.1 39.71,48.18 43.26,48.18 45.74,45.7 U$49.4
GND  (via drill 0.55, 0.6)
  Top 0.254: U$1.P1 58.33,9.4 58.93,9.4 | 93.18,14.18 93.18,14.35 | U$3.4 58.92,10.87 58.93,10.87
  Top 0.305: 29.97,17.65 U2.3 | U2.4 U2.3 | U2.3 U2.2 U2.1
  Top 0.406: U2.7 v29.39,19.56 | v29.39,19.56 29.39,19.38 29.97,18.8 29.97,17.65 | BATTERY_VOLTAGE_DIVIDER_LOW.P$3 55.06,36.01 62.1,43.05 U$6.P$1 | U$42.A1 32.26,30.37 | 18.76,20.03 17.02,18.29 17.02,8.13 18.75,6.4 | 18.75,6.4 U$45.4 | v29.39,19.56 v29.39,19.55 | v22.14,27.03 22.1,27.08 22.1,27.18 | U$47.4 18.75,6.4 | U$36.2 31.64,17.58 U2.4 | 59.56,24 58.93,23.37 | U$14.A1 6.59,6.98 R1.P$1
  Top 0.508: v94.49,15.75 94.49,15.66 93.18,14.35 | v94.49,32.26 93.49,31.26 MOTOR_ENABLE_MOSFET1.2 | 61.7,13.44 U$32.1 | 5V_LED.C 59.56,24 | 61.7,29.95 U$30.1 | U1.6 U1.5 20.36,27.64 | 20.36,27.64 20.83,27.18 22.1,27.18 U1.39 30.99,27.18 32.26,28.45 32.26,30.37 | 20.36,27.64 19.9,27.18 18.29,27.18 | 18.29,27.18 U1.17 9.89,27.18 U$16.A1 | 18.29,27.18 18.76,26.71 U1.27 18.76,20.03 | U$48.1 34.29,30.48 32.15,30.48 U$42.A1 | U$47.4 13.93,6.98 U$14.A1 | U$46.2 39.95,41.66 37.81,39.52 U$18.A1 | 3V3_REGULATOR_FOR_PROPELLER.GND 43.53,32.24 43.5,32.27 | U$26.1 56.13,6.67 U$1.P1 | 3.3V_LED.C 4.17,8 4.95,7.21 R1.P$1
  Top 0.61: 75.44,9.96 U$17.GND | 75.56,7.37 75.44,7.49 | MOTOR_MOSFET_PULLDOWN.P$2 93.18,11.56 MOTOR_ENABLE_MOSFET.2 93.18,14.18 | MOTOR_ENABLE_MOSFET1.2 92.95,31.21 MOTOR_PULLUP2.P$2 | MOTOR_LED.C 60.83,7.49 58.93,9.4 58.93,10.87 58.93,11.94 U$5.A1 | U$46.2 U$49.2
  Top 1.016: 43.5,32.27 43.5,28.64 v48.77,23.37 49.58,22.55 58.93,22.55 | 58.93,11.94 58.93,14.48
  Top 1.27: 75.44,7.49 75.44,9.96 | MOTOR_TRIM.P$2 75.56,7.37 74.3,7.37 v74.17,7.49 | 75.41,24 RTRIM_5V.P$2 | U$32.1 U$28.1 U$41.1 U$40.1 | U$40.1 U$32.1 | U$30.1 U$29.1 U$31.1 U$33.1 | U$30.1 U$33.1 | U$40.1 69.32,13.44 v71.63,15.75 | U$33.1 69.32,29.95 v71.63,32.26 | U$30.1 59.16,29.95 58.93,29.72 58.93,23.37 58.93,22.55 58.93,14.48 59.97,13.44 U$32.1 | U$4.GND 75.41,24 | v74.17,24 75.41,24
  Bottom 0.406: U$45.4 U$24.4 U$23.4 U$25.4 | v29.39,19.55 22.02,26.92 22.03,26.92 v22.14,27.03
  Bottom 0.508: U$22.P9 27.18,43.69 34.8,36.07 U$48.1
  Bottom 0.61: U$46.2 36.68,38.42 36.68,30.73
  Bottom 0.813: v48.77,23.37 48.77,25.91 43.94,30.73 36.68,30.73 35.05,30.73
  Bottom 1.016: U$48.1 35.05,30.73
  Bottom 1.27: v71.63,32.26 79.88,32.26 | 79.88,32.26 v94.49,32.26 97.03,34.8 U$13.P$2 | U$6.P$1 62.1,41.78 v71.63,32.26 | U$2.P$2 79.88,32.26 | v74.17,7.49 74.17,13.21 v71.63,15.75 v94.49,15.75 94.49,22.1 U$19.P1 94.23,22.35 U$38.1 | v71.63,32.26 71.63,29.08 74.17,26.54 v74.17,24
INT
  Top 0.254: 50.2,15.66 50.2,15.78 | 50.2,15.78 U$10.A1 | 50.2,15.78 51.29,14.69 51.99,14.69 52.51,14.16 U$3.5 52.44,13.54
  Top 0.406: U1.33 23.55,21.35 29.15,15.75 43.94,15.75 45.03,14.66 49.2,14.66 50.2,15.66
KILL  (via drill 0.4, 0.55)
  Top 0.254: v48.74,11.96 49.06,11.96 U$3.8
  Top 0.406: U1.31 21.94,19.72 27.94,13.72 v37.59,13.72 | U$27.A1 39.28,16.86 v39.32,16.89
  Bottom 0.406: v48.74,11.96 44.68,11.96 42.93,13.72 39.34,13.72 | 39.34,13.72 v37.59,13.72 | v39.32,16.89 39.32,13.74 39.34,13.72
MOTORS_ENABLE  (via drill 0.4)
  Top 0.406: U1.42 27.53,29.58 28.14,30.2 v28.14,30.25 | v84.94,17.45 88.88,13.51 MOTOR_ENABLE_MOSFET.1
  Top 0.61: MOTOR_ENABLE_MOSFET.1 91.28,11.56 MOTOR_MOSFET_PULLDOWN.P$3
  Bottom 0.406: v28.14,30.25 30.63,30.25 33.65,27.24 44.86,27.24 46.75,25.34 46.75,22 51.28,17.48 84.91,17.48 v84.94,17.45
N$1  (via drill 0.55)
  Top 0.305: U1.7 18.77,31.82 19.17,31.41 19.17,31.17 v19.35,30.99
  Bottom 0.305: U$48.2 32.08,31.17 19.53,31.17 v19.35,30.99
N$3
  Top 0.406: U1.24 16.35,20.45 14.57,18.67 14.57,17.65 9.96,13.04 U$20.A1
N$4
  Top 0.254: 53.85,6.94 U$1.P2 51.21,9.59 U$3.2
  Top 0.508: U$26.2 53.59,6.68 53.85,6.94
N$5
  Top 0.508: MOTOR_LED_R.P$2 MOTOR_LED.A
N$6  (via drill 0.4, 0.9)  (1 unrouted)
  Top 0.254: 53.16,18.67 53.1,18.62 | U$3.1 v49.72,10.86 | v52.81,15.57 53.96,16.72 U$7.C2
  Top 0.406: 53.16,18.67 53.14,18.65 v53.14,18.62
  Top 0.61: U$7.C2 54.48,18.62 54.48,18.92
  Top 0.813: U$12.1 51.95,18.93 51.64,18.62 v53.14,18.62 | v53.14,18.62 53.14,20.49 U$12.2 | U$12.3 54.49,18.93 54.48,18.92 | 54.48,18.62 v53.14,18.62
  Top 1.27: U$39.3 51.66,39.5 v53.67,39.5 53.7,39.5
  Bottom 0.254: v49.72,10.86 49.72,12.48 v52.81,15.57
  Bottom 1.27: 53.16,18.67 53.16,38.3 53.67,38.82 v53.67,39.5
N$7
  Top 0.254: U$5.C2 51.97,11.94 51.28,12.63 51.28,13.4 U$3.7
N$8
  Top 0.254: U$3.6 51.93,13.4 51.93,12.7 52.15,12.48 53.12,12.48 54.48,13.84
  Top 0.61: U$9.A1 56.39,13.21 55.12,13.21 54.48,13.84 U$7.A1
N$9
  Top 0.61: MOTOR_PULLUP.P$2 86.33,21.46 87.88,21.46 88.11,21.24 U$17.ON/OFF 88.13,18.67 91.44,18.67 92.23,17.88 MOTOR_ENABLE_MOSFET.3
N$10
  Top 0.61: U$12.4 55.76,18.92 56.39,18.29 U$9.C2
N$11
  Top 0.406: U$20.C2 8.64,10.99 6.38,8.74 R1.P$2
N$12
  Top 0.406: U1.23 13.21,19.12 13.21,18.29 U$21.1
N$13
  Top 0.406: U1.22 13.86,21.48 U$21.2
N$14
  Top 0.406: U1.21 12.53,23.96 11.68,23.11 11.68,21.84 U$21.3
N$15
  Top 0.406: U$36.3 35.05,17.03 36.3,18.28 36.3,20.09 37.19,20.99 U$35.A 41.02,20.99 U$34.-
N$16
  Top 0.254: U$36.1 35.04,19.08
  Top 0.406: U$36.1 34.99,20.52 U$37.C2
N$17
  Top 0.406: U1.20 12.09,24.79 U$21.4
N$18  (via drill 3.17)
  other vias: 3.81,49.28
N$19  (via drill 3.17)
  other vias: 3.81,3.56
N$20  (via drill 3.17)
  other vias: 102.87,49.28
N$21
  Top 0.61: RTRIM_5V.P$3 79.57,24 | 79.57,24 79.57,26.44 U$4.TRIM | 5V_C_680PF.P$3 79.57,24
N$22  (via drill 3.17)
  other vias: 102.87,3.56
N$23
  Top 0.508: 5V_LED_R2.P$2 6.5,13.77 6.2,14.07 4.34,14.07 4.17,13.89 3.3V_LED.A
N$24
  Top 1.27: U$6.P$2 57,43.71 56.97,43.71 56.42,44.26 U$39.1 U$39.2
N$26
  Top 0.406: U1.38 34.29,26.37 34.29,26.42 U$48.3
N$29
  Top 0.61: 5V_LED.A 5V_LED_R1.P$2
N$32
  Top 0.61: 5V_REGULATOR_PULLUP.P$2 88.11,36.46 U$4.ON/OFF 90.27,35.2 91.95,33.53 MOTOR_ENABLE_MOSFET1.3
N$33
  Top 0.61: 5V_C_680PF.P$2 5V_R_220.P$2
N$35
  Top 0.61: MOTOR_TRIM.P$3 79.5,7.37 | 79.5,7.37 U$17.TRIM | MOTOR_C_680PF.P$3 79.5,7.37
N$37
  Top 0.61: MOTOR_C_680PF.P$2 MOTOR_R_220.P$2
N$299
  Top 0.406: U1.37 33.53,25.57 33.53,24.64 U$48.4
N$300
  Top 0.406: U1.28 19.56,19.56 17.78,17.78 17.78,9.91 18.29,9.4 18.34,9.45 U$15.1
N$301
  Top 0.406: U1.29 20.35,15.98 U$15.2
P9
  Top 0.406: U$22.P8 24.64,44.96 24.64,43.1 16.38,34.84 U1.10
P10
  Top 0.406: U1.11 15.56,35.37 23.37,43.18 U$22.P7
P11
  Top 0.406: U$22.P6 20.83,46.16 22.04,44.95 22.04,42.87 13.97,34.8 13.97,31.29 U1.12
P12
  Top 0.406: U$22.P5 20.83,42.93 12.19,34.29 12.19,30.48 12.29,30.38 U1.13
P13
  Top 0.406: U$22.P4 18.29,45.97 19.56,44.7 19.56,42.93 11.43,34.8 11.43,30.23 12.08,29.58 U1.14
P14
  Top 0.406: U$22.P3 18.29,42.93 10.67,35.31 10.67,29.97 11.88,28.76 U1.15
P15
  Top 0.406: U$22.P2 15.75,45.97 17.02,44.7 17.02,42.93 9.91,35.81 9.91,29.72 11.68,27.94 13.8,27.94 U1.16
P16
  Top 0.406: U$22.P1 15.75,42.84 7.81,34.9 7.81,25.23 8.33,24.71 10.21,24.71 11.08,25.58 U1.19
PROCESSOR_ENABLE
  Top 0.406: U1.43 26.3,30.37 27.39,31.45 33.55,31.45 35.55,33.45 46.84,33.45 49.57,30.73 53.11,30.73 61.85,39.47 87.85,39.47 92.98,34.34 92.98,32.8 92.36,32.17 91.91,32.17 MOTOR_ENABLE_MOSFET1.1
  Top 0.61: MOTOR_ENABLE_MOSFET1.1 90.95,31.21 MOTOR_PULLUP2.P$3
RX
  Top 0.406: U$47.2 16.36,12.25 16.36,18.56 17.95,20.16 U1.26
SCL  (via drill 0.4)
  Top 0.406: U2.6 30.04,20.5 v30.48,20.07 | U1.35 27.59,23.97 v27.68,23.88
  Bottom 0.406: v27.68,23.88 v27.69,23.88 30.48,21.08 v30.48,20.07 30.48,18.8 24.13,12.45 24.13,11.13 24.86,10.4 U$45.2 U$24.2 U$23.2 U$25.2
SDA  (via drill 0.55)
  Top 0.305: U2.5 30.69,23.16 R25.P$2
  Top 0.406: R25.P$2 30.48,24.64 | 30.48,24.64 30.35,24.77 U1.36 | v31.75,23.19 31.93,23.19 30.48,24.64
  Bottom 0.406: v31.75,23.19 31.75,18.21 U$45.1 U$24.1 U$23.1 U$25.1
SERVO
  Top 0.406: U$38.3 87.88,3.05 52.83,3.05 41.01,14.87 28.09,14.87 22.76,20.21 U1.32
SPEAKER  (via drill 0.55)
  Top 0.406: U1.41 28.26,28.77 28.65,29.16 v28.7,29.16 | v33.02,22.35 33.04,22.34 U$37.A1
  Bottom 0.406: v28.7,29.16 28.7,28.45 33.02,24.13 v33.02,22.35
TX
  Top 0.406: U$47.1 15.7,13.59 15.7,18.84 17.16,20.3 U1.25

### Text on the board
Top: The diode for the speaker is too small and I can't see a marking on it
tPlace: CPU | Battery | Motors | ENC0 | ENC1 | Bat+ | GND | 5V | GND | 6V | GND | 15 | 13 | 11 | 9 | + | AUX | 16 | 14 | 12 | 10 | GND | 5V | PWMs | 0 | 5V | 1 | 2 | motor | 3 | low-level controler / 2021 Rev 1.1 | 3.3V | TX | SDA | RX | SCL | 3.3V | 3.3V | GND | GND | 6V | Serial | I2C | I2C | I2C | I2C | Button | Servo
Reference: 10K | .1uf | 1.6K | 100K | 150K | 1000pF | 1000pF | 11K | 10K | .1uf | 10K | 470 | 16.2K | 680pF | 220 | 10K | 200 | 10K | 10K | 100K | 100K | 470 | 1uF | 10K | 240 | .1uF | 600 | 13.3K | 680pF | 220